# Altium schematic sheet Schematic.schdoc
size 257 x 173 mm
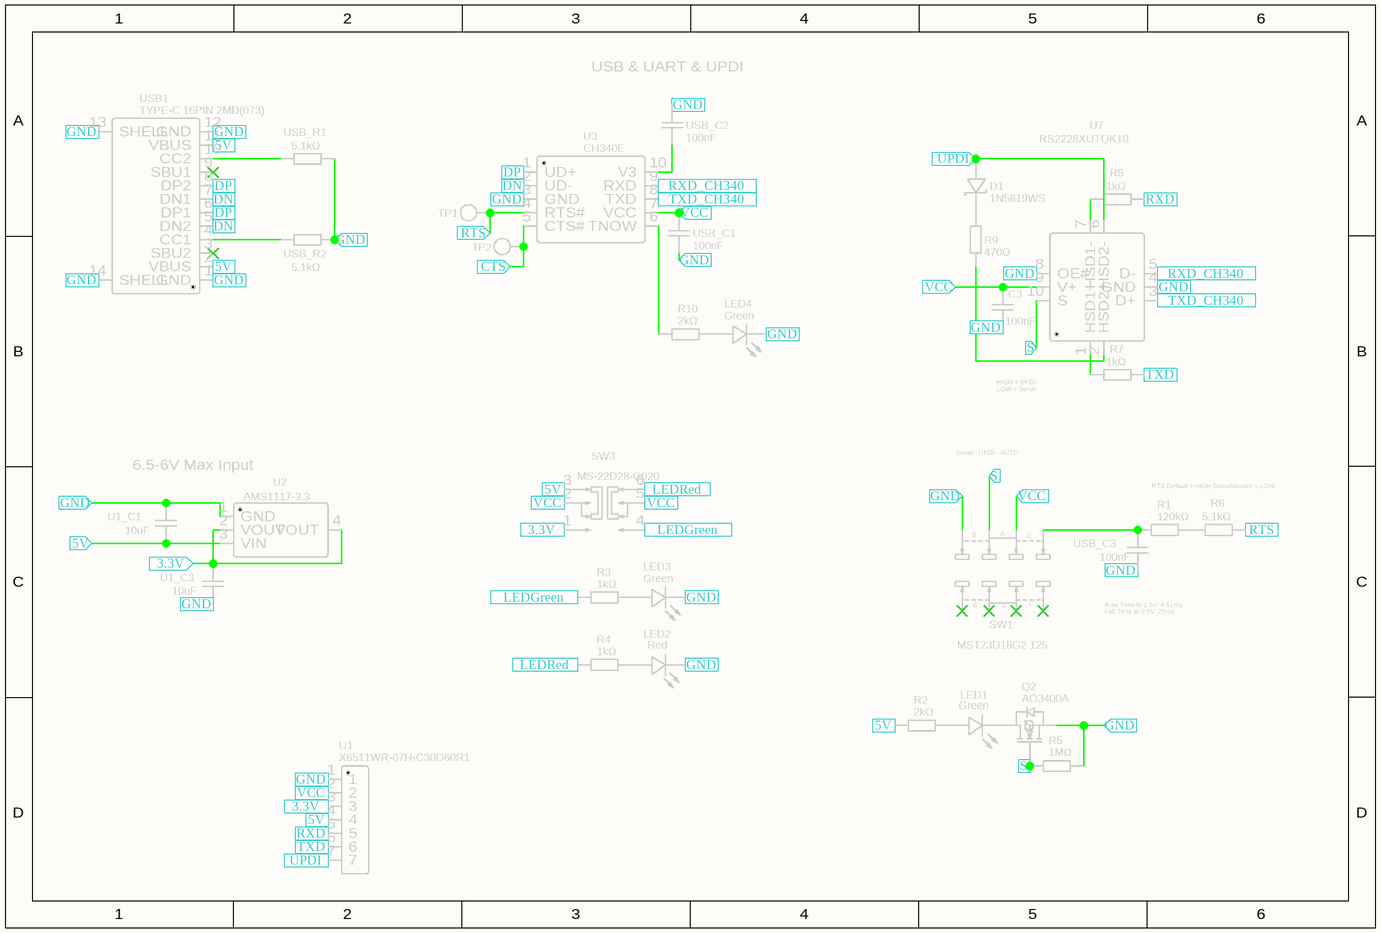
[diagram p0: Schematic.schdoc]

## Parts
C3  100nF  [C0402]
D1  1N5819WS  [SOD-323_L1.8-W1.3-LS2.5-RD]
LED1  Green  [LED0805-R-RD]
LED2  Red  [LED0805-R-RD]
LED3  Green  [LED0805-R-RD]
LED4  Green  [LED0805-R-RD]
Q2  AO3400A  [SOT-23-3_L2.9-W1.3-P1.90-LS2.4-BR]
R1  120kΩ  [R0603]
R2  2kΩ  [R0402]
R3  1kΩ  [R0402]
R4  1kΩ  [R0402]
R5  1MΩ  [R0402]
R6  5.1kΩ  [R0402]
R7  1kΩ  [R0402]
R8  1kΩ  [R0402]
R9  470Ω  [R0402]
R10  2kΩ  [R0402]
SW1  MST23D18G2 125  [SW-SMD_SHOU_MST23D18G2]
SW3  MS-22D28-G020  [SW-SMD_MS-22D28-G020]
TP1  TESTPOINT  [TEST_TESTPOINT]  (value not drawn)
TP2  TESTPOINT  [TEST_TESTPOINT]  (value not drawn)
U1  X6511WR-07H-C30D60R1  [HDR-TH_7P-P2.54-H-M-W7.7-P]
U1_C1  10uF  [C0402]
U1_C3  10uF  [C0402]
U2  AMS1117-3.3  [SOT-223-3_L6.5-W3.4-P2.30-LS7.0-BR]
U3  CH340E  [MSOP-10_L3.0-W3.0-P0.50-LS5.0-BL]
U7  RS2228XUTQK10  [WQFN-10_L1.8-W1.4-P0.40-BL]
USB1  TYPE-C 16PIN 2MD(073)  [USB-C-SMD_TYPE-C-6PIN-2MD-073]
USB_C1  100nF  [C0402]
USB_C2  100nF  [C0402]
USB_C3  100nF  [C0402]
USB_R1  5.1kΩ  [R0402]
USB_R2  5.1kΩ  [R0402]

## Ports
3.3V (in), 5V (in), CTS (in), DN (in), DP (in), GND (in), LEDGreen (in), LEDRed (in), RTS (in), RXD (in), RXD_CH340 (in), S (in), TXD (in), TXD_CH340 (in), UPDI (in), VCC (in)

## Nets
3.3V: SW3.1 U1.3 U1_C3.2 U2.2(VOUT) U2.4(VOUT) ; port 3.3V
5V: R2.1 SW3.3 U1.4 U1_C1.1 U2.3(VIN) USB1.2(VBUS) USB1.11(VBUS) ; port 5V
CTS: TP2.1 U3.5(CTS#) ; port CTS
DN: U3.2(UD-) USB1.5(DN2) USB1.7(DN1) ; port DN
DP: U3.1(UD+) USB1.6(DP1) USB1.8(DP2) ; port DP
GND: C3.1 LED2.2(-) LED3.2(K) LED4.2(K) Q2.2(S) R5.2 SW1.8 U1.1 U1_C1.2 U1_C3.1 U2.1(GND) U3.3(GND) U7.4(GND) U7.8(OE#) USB1.1(GND) USB1.12(GND) USB1.13(SHELL) USB1.14(SHELL) USB_C1.1 USB_C2.2 USB_C3.1 USB_R1.2 USB_R2.2 ; port GND
LEDGreen: R3.1 SW3.4 ; port LEDGreen
LEDRed: R4.1 SW3.6 ; port LEDRed
RTS: R6.2 TP1.1 U3.4(RTS#) ; port RTS
RXD: R8.2 U1.5 ; port RXD
RXD_CH340: U3.9(RXD) U7.5(D-) ; port RXD_CH340
S: Q2.1(G) R5.1 SW1.7 U7.10(S) ; port S
TXD: R7.2 U1.6 ; port TXD
TXD_CH340: U3.8(TXD) U7.3(D+) ; port TXD_CH340
UPDI: D1.2(A) U1.7 U7.6(HSD2-) ; port UPDI
VCC: C3.2 SW1.6 SW3.2 SW3.5 U1.2 U3.7(VCC) U7.9(V+) USB_C1.2 ; port VCC
NetD1_1: D1.1(K) R9.2
NetLED1_1: LED1.1(A) R2.2
NetLED1_2: LED1.2(K) Q2.3(D)
NetLED2_1: LED2.1(+) R4.2
NetLED3_1: LED3.1(A) R3.2
NetLED4_1: LED4.1(A) R10.2
NetR1_1: R1.1 SW1.5 USB_C3.2
NetR1_2: R1.2 R6.1
NetR7_1: R7.1 U7.1(HSD1+)
NetR8_1: R8.1 U7.7(HSD1-)
NetR9_1: R9.1 U7.2(HSD2+)
NetR10_1: R10.1 U3.6(TNOW)
NetU3_10: U3.10(V3) USB_C2.1
NetUSB1_4: USB1.4(CC1) USB_R2.1
NetUSB1_10: USB1.10(CC2) USB_R1.1

Not connected (* = marked no-connect by the designer): SW1 1* 2* 3* 4*; USB1 3(SBU2)* 9(SBU1)*

## Notes on the sheet
- (near USB_C2) USB & UART & UPDI
- (near R7) HIGH = UPDI
  LOW = Serial
- 6.5-6V Max Input
- Serial - UPDI - AUTO
- RTS Default = HIGH SerialMonitor = LOW
- Rise Time to 1.6V: 4.51ms
  Fall Time to 0.5V: 25ms
- (in symbol MST23D18G2 125) A; B; C

## Library data of the parts
C3 USB_C1-USB_C3 = 100nF: Manufacturer Part: CL05B104KO5NNNC; Manufacturer: SAMSUNG(三星); nameAlias: Value; Supplier: LCSC; Supplier Part: C1525; JLCPCB Part Class: Basic Part; spicePre: C; spiceSymbolName: CL05B104KO5NNNC
D1 = 1N5819WS: Manufacturer: Hottech(合科泰); Contributor: LCSC; Supplier: LCSC; Supplier Part: C191023; Manufacturer Part: 1N5819WS; JLCPCB Part Class: Basic Part; spicePre: D; spiceSymbolName: 1N5819WS
LED1 LED3 LED4 = Green: Manufacturer: KENTO; Manufacturer Part: KT-0805G; Supplier: LCSC; Supplier Part: C2297; JLCPCB Part Class: Basic Part; spicePre: L; spiceSymbolName: 0805G (Green)
LED2 = Red: Manufacturer: 国星光电; Manufacturer Part: NCD0805R1; Supplier: LCSC; Supplier Part: C84256; JLCPCB Part Class: Basic Part; spicePre: L; spiceSymbolName: FC-2012HRK-620D
Q2 = AO3400A: Manufacturer: AOS; Supplier: LCSC; Manufacturer Part: AO3400A; Supplier Part: C20917; JLCPCB Part Class: Basic Part; spicePre: Q; spiceSymbolName: AO3400A
R1 = 120kΩ: Manufacturer: UNI-ROYAL(厚声); Manufacturer Part: 0603WAF1203T5E; nameAlias: Value; Supplier: LCSC; Supplier Part: C25808; JLCPCB Part Class: Basic Part; spicePre: R; spiceSymbolName: 0603WAF1203T5E
R2 R10 = 2kΩ: Manufacturer Part: 0402WGF2001TCE; Manufacturer: UNI-ROYAL(厚声); nameAlias: Value; Supplier: LCSC; Supplier Part: C4109; JLCPCB Part Class: Basic Part; spicePre: R; spiceSymbolName: 0402WGF2001TCE
R3 R4 R7 R8 = 1kΩ: Manufacturer: UNI-ROYAL(厚声); Manufacturer Part: 0402WGF1001TCE; nameAlias: Value; Supplier: LCSC; Supplier Part: C11702; JLCPCB Part Class: Basic Part; spicePre: R; spiceSymbolName: 0402WGF1001TCE
R5 = 1MΩ: Manufacturer: UNI-ROYAL(厚声); Manufacturer Part: 0402WGF1004TCE; nameAlias: Value; Supplier: LCSC; Supplier Part: C26083; JLCPCB Part Class: Basic Part; spicePre: R; spiceSymbolName: 0402WGF1004TCE
R6 USB_R1 USB_R2 = 5.1kΩ: Manufacturer: UNI-ROYAL(厚声); Manufacturer Part: 0402WGF5101TCE; nameAlias: Value; Supplier: LCSC; Supplier Part: C25905; JLCPCB Part Class: Basic Part; spicePre: R; spiceSymbolName: 0402WGF5101TCE
R9 = 470Ω: Manufacturer: UNI-ROYAL(厚声); Manufacturer Part: 0402WGF4700TCE; nameAlias: Value; Supplier: LCSC; Supplier Part: C25117; JLCPCB Part Class: Basic Part; spicePre: R; spiceSymbolName: 0402WGF4700TCE
SW1 = MST23D18G2 125: Manufacturer: SHOU HAN(首韩); Contributor: LCSC; Supplier: LCSC; Supplier Part: C2906281; Manufacturer Part: MST23D18G2 125; JLCPCB Part Class: Extended Part; spicePre: S; spiceSymbolName: MST23D18G2 125
SW3 = MS-22D28-G020: Manufacturer: G-Switch(品赞); Contributor: LCSC; Supplier: LCSC; Supplier Part: C963205; Manufacturer Part: MS-22D28-G020; JLCPCB Part Class: Extended Part; spicePre: S; spiceSymbolName: MS-22D28-G020
TP1 TP2 = TESTPOINT: Contributor: Tech Guy; spicePre: T; spiceSymbolName: TEST_TESTPOINT
U1 = X6511WR-07H-C30D60R1: Manufacturer: XKB Connection(中国星坤); Manufacturer Part: X6511WR-07H-C60D30R1; Contributor: LCSC; Supplier: LCSC; Supplier Part: C2883845; JLCPCB Part Class: Extended Part; spicePre: U; spiceSymbolName: X6511WR-07H-C30D60R1
U1_C1 U1_C3 = 10uF: Manufacturer Part: CL05A106MQ5NUNC; Manufacturer: SAMSUNG(三星); nameAlias: Capacitance; Supplier: LCSC; Supplier Part: C15525; JLCPCB Part Class: Basic Part; spicePre: C; spiceSymbolName: CL05A106MQ5NUNC
U2 = AMS1117-3.3: Manufacturer: AMS; sourceId: dwIGgezVh; timeStamp: 1476261164; Supplier: LCSC; Manufacturer Part: AMS1117-3.3; Supplier Part: C6186; JLCPCB Part Class: Basic Part; spicePre: U; spiceSymbolName: AMS1117-3.3
U3 = CH340E: Manufacturer: WCH(南京沁恒); Supplier: LCSC; Manufacturer Part: CH340E; Supplier Part: C99652; JLCPCB Part Class: Extended Part; spicePre: U; spiceSymbolName: CH340E
U7 = RS2228XUTQK10: Manufacturer: RUNIC(润石); Contributor: LCSC; Supplier: LCSC; Supplier Part: C255479; Manufacturer Part: RS2228XUTQK10; JLCPCB Part Class: Extended Part; spicePre: U; spiceSymbolName: RS2228XUTQK10
USB1 = TYPE-C 16PIN 2MD(073): Manufacturer: SHOU HAN(首韩); Contributor: LCSC; Supplier: LCSC; Supplier Part: C2765186; Manufacturer Part: TYPE-C 16PIN 2MD(073); JLCPCB Part Class: Extended Part; spicePre: U; spiceSymbolName: TYPE-C 16PIN 2MD(073)